# EAGLE design untitled (EAGLE 9.6.2)
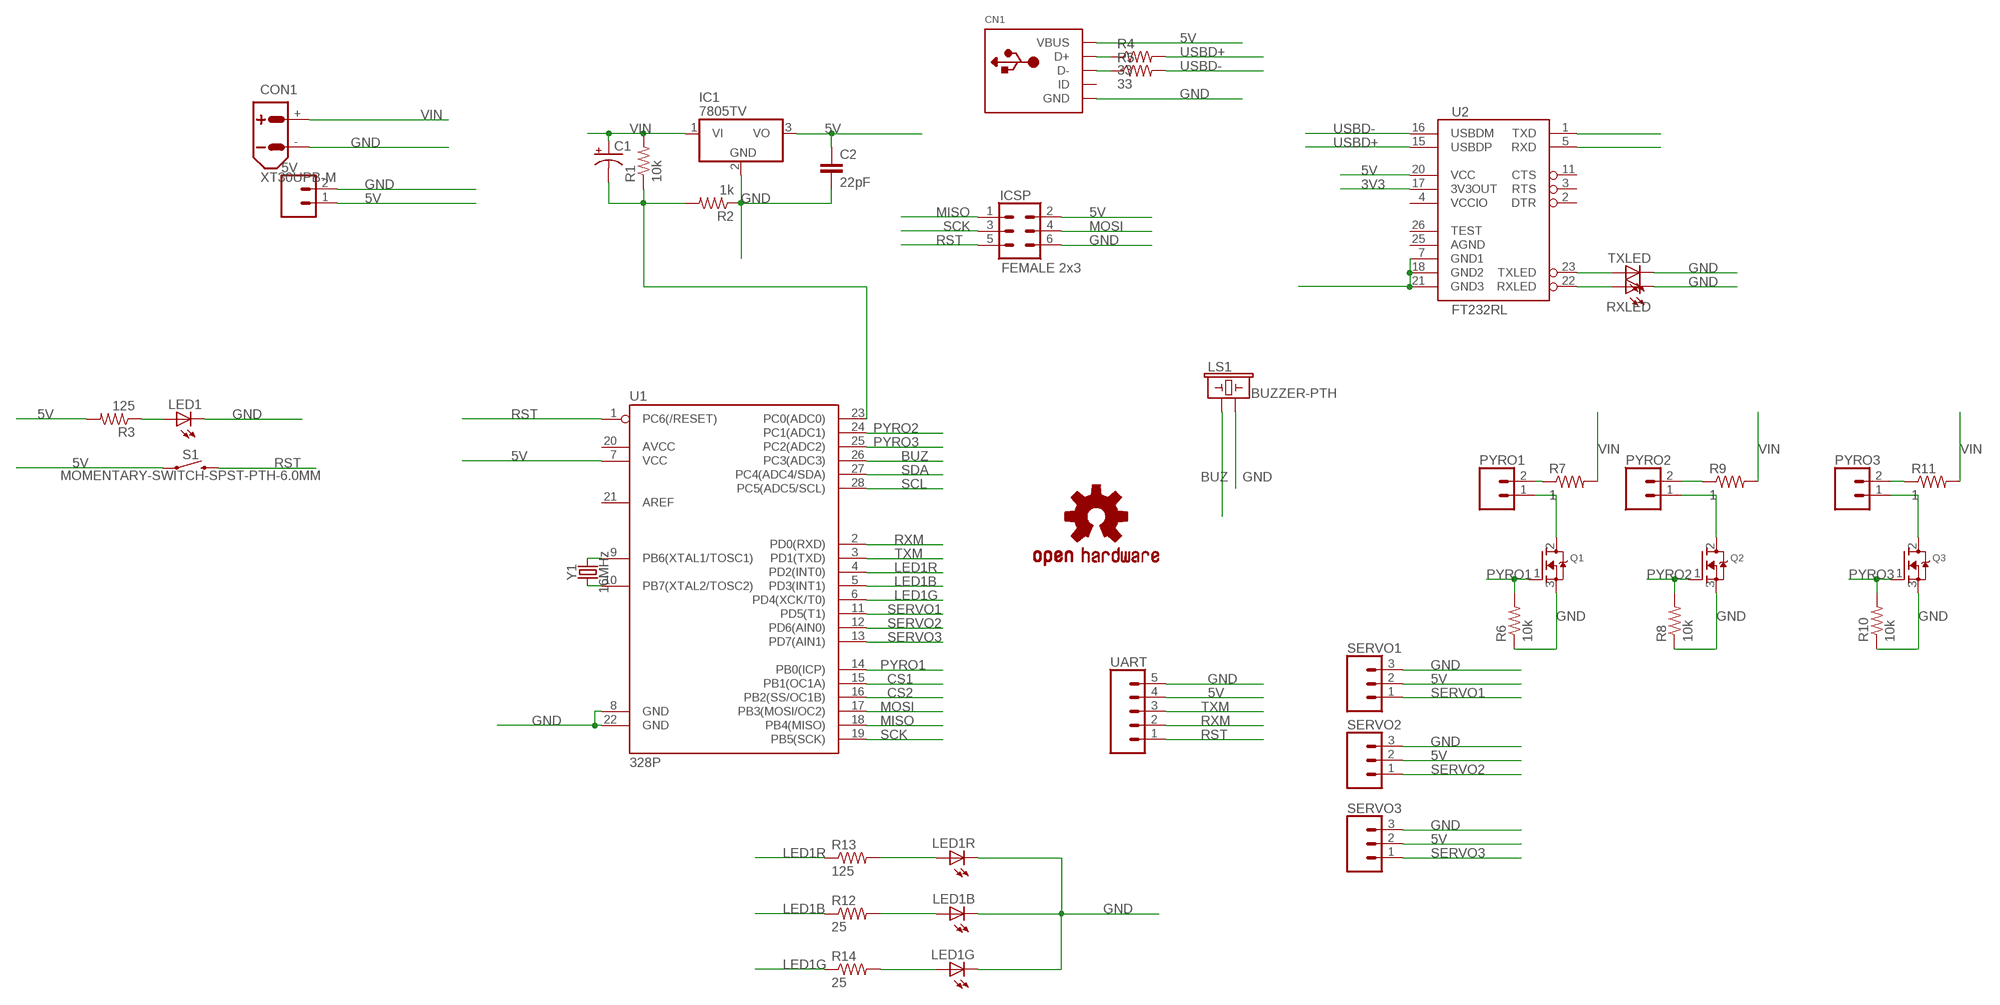
[diagram p0: schematic, sheet 1]

## Parts
5V  CONN_02  [1X02]
C1  CPOL-USE3.5-8  [E3,5-8]
C2  22pF  22PF-PTH-2.54MM-200V-5%  [CAP-PTH-2.54]
CN1  USBMINIB  [USB-MINIB]
CON1  XT30UPB-M  [XT30UPB-M]
IC1  7805TV  [TO220V]
ICSP  FEMALE 2x3  CONN_03X2FEMALE  [2X3]
LED1  LED5MM  [LED5MM]
LED1B  LED1B  LED5MM  [LED5MM]
LED1G  LED1G  LED5MM  [LED5MM]
LED1R  LED1R  LED5MM  [LED5MM]
LOGO1  OSHW-LOGOL  [OSHW-LOGO-L]
LS1  BUZZER-PTH  [BUZZER-12MM]
PYRO1  CONN_025MM  [SCREWTERMINAL-5MM-2]
PYRO2  CONN_025MM  [SCREWTERMINAL-5MM-2]
PYRO3  CONN_025MM  [SCREWTERMINAL-5MM-2]
Q1  MOSFET-NGDS_TO220V  [TO220V]
Q2  MOSFET-NGDS_TO220V  [TO220V]
Q3  MOSFET-NGDS_TO220V  [TO220V]
R1  10k  FLIPFLOP-RES  [0805-THM]
R2  1k  FLIPFLOP-RES  [0805-THM]
R3  125  FLIPFLOP-RES  [0805-THM]
R4  33  FLIPFLOP-RES  [0805-THM]
R5  33  FLIPFLOP-RES  [0805-THM]
R6  10k  FLIPFLOP-RES  [0805-THM]
R7  1  FLIPFLOP-RES  [0805-THM]
R8  10k  FLIPFLOP-RES  [0805-THM]
R9  1  FLIPFLOP-RES  [0805-THM]
R10  10k  FLIPFLOP-RES  [0805-THM]
R11  1  FLIPFLOP-RES  [0805-THM]
R12  25  FLIPFLOP-RES  [0805-THM]
R13  125  FLIPFLOP-RES  [0805-THM]
R14  25  FLIPFLOP-RES  [0805-THM]
RXLED  LED5MM  [LED5MM]
S1  MOMENTARY-SWITCH-SPST-PTH-6.0MM  [TACTILE_SWITCH_PTH_6.0MM]
SERVO1  CONN_03  [1X03]
SERVO2  CONN_03  [1X03]
SERVO3  CONN_03  [1X03]
TXLED  LED5MM  [LED5MM]
U1  328P  ATMEGA328P_PDIP  [DIP28]
U2  FT232RL  FT232RL-BASICSSOP  [SSOP28DB]
UART  CONN_05  [1X05]
Y1  16MHz  CRYSTAL-16MHZPTH-HC49US  [HC49US]

## Nets
3V3: U2.17(3V3OUT)
5V: 5V.1 C2.1 CN1.VBUS IC1.3(VO) ICSP.2 R3.2 S1.1 SERVO1.2 SERVO2.2 SERVO3.2 U1.7(VCC) U2.20(VCC) UART.4
BUZ: LS1.+ U1.26(PC3(ADC3))
CS1: U1.15(PB1(OC1A))
CS2: U1.16(PB2(SS/OC1B))
GND: 5V.2 C2.2 CN1.GND CON1.- IC1.2(GND) ICSP.6 LED1.K(C) LED1B.K(C) LED1G.K(C) LED1R.K(C) LS1.- Q1.3(S) Q2.3(S) Q3.3(S) R2.1 R6.1 R8.1 R10.1 RXLED.K(C) SERVO1.3 SERVO2.3 SERVO3.3 TXLED.K(C) U1.8(GND) U1.22(GND) UART.5
LED1B: R12.1 U1.5(PD3(INT1))
LED1G: R14.1 U1.6(PD4(XCK/T0))
LED1R: R13.1 U1.4(PD2(INT0))
MISO: ICSP.1 U1.18(PB4(MISO))
MOSI: ICSP.4 U1.17(PB3(MOSI/OC2))
N$1: U1.9(PB6(XTAL1/TOSC1)) Y1.2
N$2: U1.10(PB7(XTAL2/TOSC2)) Y1.1
N$3: C1.- R1.1 R2.2 U1.23(PC0(ADC0))
N$4: CN1.D+ R4.1
N$5: U2.7(GND1) U2.18(GND2) U2.21(GND3)
N$6: U2.1(TXD)
N$7: U2.5(RXD)
N$8: TXLED.A U2.23(TXLED)
N$9: LED1.A R3.1
N$10: CN1.D- R5.1
N$11: RXLED.A U2.22(RXLED)
N$15: PYRO1.1 Q1.2(D)
N$16: PYRO1.2 R7.1
N$17: PYRO2.1 Q2.2(D)
N$18: PYRO2.2 R9.1
N$19: PYRO3.1 Q3.2(D)
N$20: PYRO3.2 R11.1
N$21: LED1R.A R13.2
N$22: LED1B.A R12.2
N$23: LED1G.A R14.2
PYRO1: Q1.1(G) R6.2 U1.14(PB0(ICP))
PYRO2: Q2.1(G) R8.2 U1.24(PC1(ADC1))
PYRO3: Q3.1(G) R10.2 U1.25(PC2(ADC2))
RST: ICSP.5 S1.3 U1.1(PC6(/RESET)) UART.1
RXM: U1.2(PD0(RXD)) UART.2
SCK: ICSP.3 U1.19(PB5(SCK))
SCL: U1.28(PC5(ADC5/SCL))
SDA: U1.27(PC4(ADC4/SDA))
SERVO1: SERVO1.1 U1.11(PD5(T1))
SERVO2: SERVO2.1 U1.12(PD6(AIN0))
SERVO3: SERVO3.1 U1.13(PD7(AIN1))
TXM: U1.3(PD1(TXD)) UART.3
USBD+: R4.2 U2.15(USBDP)
USBD-: R5.2 U2.16(USBDM)
VIN: C1.+ CON1.+ IC1.1(VI) R1.2 R7.2 R9.2 R11.2
Unconnected: CN1.ID U1.20(AVCC) U1.21(AREF) U2.2(DTR) U2.3(RTS) U2.11(CTS) U2.26(TEST)

## Power pins joined to a net without a drawn wire
AGND: U2.25(AGND)
VCCIO: U2.4(VCCIO)

## Library data of the parts
5V = SparkFun-Connectors:CONN_02: Multi connection point. Often used as Generic Header-pin footprint for 0.1 inch spaced/style header connections On any of the 0.1 inch spaced packages, you can populate with these: Break Away Headers - Straight <https://www.sparkfun.com/products/116> (PRT-00116) Break Away Male Headers - Right Angle <https://www.sparkfun.com/products/553> (PRT-00553) Female Headers <https://www.sparkfun.com/products/115> (PRT-00115) Break Away Headers - Machine Pin <https://www.sparkfun.com/products/117> (PRT-00117) Break Away Female Headers - Swiss Machine Pin <https://www.sparkfun.com/products/743> (PRT-00743) For SCREWTERMINALS and SPRING TERMINALS visit here: Screw Terimnals on SparkFun.com <https://www.sparkfun.com/search/results?term=Screw+Terminals> (5mm/3.5mm/2.54mm spacing) This device is also useful as a general connection point to wire up your design to another part of your project. Our various solder wires solder well into these plated through hole pads. Hook-Up Wire - Assortment (Stranded, 22 AWG) <https://www.sparkfun.com/products/11375> (PRT-11375) Hook-Up Wire - Assortment (Solid Core, 22 AWG) <https://www.sparkfun.com/products/11367> (PRT-11367) View the entire wire category on our website here <https://www.sparkfun.com/categories/141> Special notes: Molex polarized connector foot print use with: PRT-08233 with associated crimp pins and housings. 2.54_SCREWTERM for use with PRT-10571. 3.5mm Screw Terminal footprints for PRT-08084 5mm Screw Terminal footprints for use with PRT-08432
C1 = rcl:CPOL-US: POLARIZED CAPACITOR, American symbol; SPICEPREFIX: C
C2 = SparkFun-Capacitors:22PF: 22pF ceramic capacitors A capacitor is a passive two-terminal electrical component used to store electrical energy temporarily in an electric field.; PROD_ID: CAP-09128
CN1 = adafruit:USB: USB Connectors USBMINIB - Surface Mount Female Mini-B USB Connector 4UConnector: 06564 By microbuilder.eu Thru-hole RA Female Mini-B USB Connector 4UConnector: 18732 By ladyada.net
CON1 = amass:XT30: AMASS XT30 connector Store in Japan AMASS XT30 connector <https://szc.jp/ams-xt30>
IC1 = linear:78*: Positive VOLTAGE REGULATOR Source: http://cache.national.com/ds/LM/LM78L05.pdf http://www.fairchildsemi.com/ds/LM/LM7805.pdf
ICSP = SparkFun-Connectors:CONN_03X2: Multi connection point. Often used as Generic Header-pin footprint for 0.1 inch spaced/style header connections You can populate with any combo of single row headers, but if you'd like an exact match, check these: Header - 2x3 (Male, 0.1") <https://www.sparkfun.com/products/12807> (PRT-12807) Header - 2x3 (Female, 0.1") <https://www.sparkfun.com/products/13010> (PRT-13010) 2x3 Pin Shrouded Header <https://www.sparkfun.com/products/10877> (PRT-10877) On any of the 0.1 inch spaced packages, you can populate with these: Break Away Headers - Straight <https://www.sparkfun.com/products/116> (PRT-00116) Break Away Male Headers - Right Angle <https://www.sparkfun.com/products/553> (PRT-00553) Female Headers <https://www.sparkfun.com/products/115> (PRT-00115) Break Away Headers - Machine Pin <https://www.sparkfun.com/products/117> (PRT-00117) Break Away Female Headers - Swiss Machine Pin <https://www.sparkfun.com/products/743> (PRT-00743) Special note: the shrouded connector mates well with our 3x2 ribbon cables: Ribbon Crimp Connector - 6-pin (2x3, Female) <https://www.sparkfun.com/products/10651> (PRT-10651) Ribbon Cable - 6 wire (15ft) <https://www.sparkfun.com/products/10646> (PRT-10646); PROD_ID: CONN-11566
LED1 LED1B LED1G LED1R RXLED TXLED = adafruit:LED: LED OSRAM: - CHIPLED LG R971, LG N971, LY N971, LG Q971, LY Q971, LO R971, LY R971 LH N974, LH R974 LS Q976, LO Q976, LY Q976 LO Q996 - Hyper CHIPLED LW Q18S LB Q993, LB Q99A, LB R99A - SideLED LS A670, LO A670, LY A670, LG A670, LP A670 LB A673, LV A673, LT A673, LW A673 LH A674 LY A675 LS A676, LA A676, LO A676, LY A676, LW A676 LS A679, LY A679, LG A679 - Hyper Micro SIDELED® LS Y876, LA Y876, LO Y876, LY Y876 LT Y87S - SmartLED LW L88C, LW L88S LB L89C, LB L89S, LG L890 LS L89K, LO L89K, LY L89K LS L896, LA L896, LO L896, LY L896 - TOPLED LS T670, LO T670, LY T670, LG T670, LP T670 LSG T670, LSP T670, LSY T670, LOP T670, LYG T670 LG T671, LOG T671, LSG T671 LB T673, LV T673, LT T673, LW T673 LH T674 LS T676, LA T676, LO T676, LY T676, LB T676, LH T676, LSB T676, LW T676 LB T67C, LV T67C, LT T67C, LS T67K, LO T67K, LY T67K, LW E67C LS E67B, LA E67B, LO E67B, LY E67B, LB E67C, LV E67C, LT E67C LW T67C LS T679, LY T679, LG T679 LS T770, LO T770, LY T770, LG T770, LP T770 LB T773, LV T773, LT T773, LW T773 LH T774 LS E675, LA E675, LY E675, LS T675 LS T776, LA T776, LO T776, LY T776, LB T776 LHGB T686 LT T68C, LB T68C - Hyper Mini TOPLED® LB M676 - Mini TOPLED Santana® LG M470 LS M47K, LO M47K, LY M47K Source: http://www.osram.convergy.de/
LOGO1 = SparkFun-Aesthetics:OSHW-LOGO: Open-Source Hardware (OSHW) Logo This logo indicates the piece of hardware it is found on incorporates a OSHW license and/or adheres to the definition of open source hardware found here: http://freedomdefined.org/OSHW
LS1 = SparkFun-Electromechanical:BUZZER: Buzzer Small round buzzers that operate around the audible 2kHz range. You can use these as speakers to create simple music or user interfaces. Variant Overview: PTH - Mini Speaker - PC Mount 12mm 2.048kHz <https://www.sparkfun.com/products/7950> PTH_KIT - Mini Speaker - PC Mount 12mm 2.048kHz <https://www.sparkfun.com/products/7950> KIT simplifies soldering by adding stop mask to one side of the pads. PTH_NO_SILK - Mini Speaker - PC Mount 12mm 2.048kHz <https://www.sparkfun.com/products/7950> No silkscreen indicator of buzzer outline. PTH_KIT_NO_SILK - Mini Speaker - PC Mount 12mm 2.048kHz <https://www.sparkfun.com/products/7950> KIT package w/o silkscreen SMD - Buzzer Audio Magnetic (CCV-084B16) SMD buzzer used on, e.g. the LilyPad Buzzer <https://www.sparkfun.com/products/8463> and RFID USB Reader <https://www.sparkfun.com/products/9963>. SMD_KIT - Buzzer Audio Magnetic (CCV-084B16) SMD Buzzer with elongated pins to make soldering easier. Used on the SparkFun Simon Says - Surface Mount Soldering Kit <https://www.sparkfun.com/products/10935>.; PROD_ID: COMP-08253; SF_SKU: COM-07950
PYRO1-PYRO3 = SparkFun-Connectors:CONN_02: Multi connection point. Often used as Generic Header-pin footprint for 0.1 inch spaced/style header connections On any of the 0.1 inch spaced packages, you can populate with these: Break Away Headers - Straight <https://www.sparkfun.com/products/116> (PRT-00116) Break Away Male Headers - Right Angle <https://www.sparkfun.com/products/553> (PRT-00553) Female Headers <https://www.sparkfun.com/products/115> (PRT-00115) Break Away Headers - Machine Pin <https://www.sparkfun.com/products/117> (PRT-00117) Break Away Female Headers - Swiss Machine Pin <https://www.sparkfun.com/products/743> (PRT-00743) For SCREWTERMINALS and SPRING TERMINALS visit here: Screw Terimnals on SparkFun.com <https://www.sparkfun.com/search/results?term=Screw+Terminals> (5mm/3.5mm/2.54mm spacing) This device is also useful as a general connection point to wire up your design to another part of your project. Our various solder wires solder well into these plated through hole pads. Hook-Up Wire - Assortment (Stranded, 22 AWG) <https://www.sparkfun.com/products/11375> (PRT-11375) Hook-Up Wire - Assortment (Solid Core, 22 AWG) <https://www.sparkfun.com/products/11367> (PRT-11367) View the entire wire category on our website here <https://www.sparkfun.com/categories/141> Special notes: Molex polarized connector foot print use with: PRT-08233 with associated crimp pins and housings. 2.54_SCREWTERM for use with PRT-10571. 3.5mm Screw Terminal footprints for PRT-08084 5mm Screw Terminal footprints for use with PRT-08432; SF_SKU: PRT-08432
Q1-Q3 = adafruit:MOSFET-N: N-Channel Mosfet 2N7002E - 60V 260mA SOT23 [Digikey: 2N7002ET1GOSTR-ND] - REEL BSH103 - 30V 850mA SOT23 [Digikey: 568-5013-1-ND]
R1-R14 = adafruit:FLIPFLOP-RES: Flip Flop resistor An 0805 resistor inside a standard 1/4W 5% resistor. Makes for easy mods
S1 = SparkFun-Switches:MOMENTARY-SWITCH-SPST: Momentary Switch (Pushbutton) - SPST Normally-open (NO) SPST momentary switches (buttons, pushbuttons). Variants PTH-12MM - 12mm square, through-hole Momentary Pushbutton Switch - 12mm Square <https://www.sparkfun.com/products/9190> (COM-09190) PTH-6.0MM, PTH-6.0MM-KIT - 6.0mm square, through-hole Mini Pushbutton Switch <https://www.sparkfun.com/products/97> (COM-00097) KIT package intended for soldering kit's - only one side of pads' copper is exposed. PTH-RIGHT-ANGLE-KIT - Right-angle, through-hole Right Angle Tactile Button <https://www.sparkfun.com/products/10791> - Used on SparkFun BigTime Watch Kit <https://www.sparkfun.com/products/11734> SMD-12MM - 12mm square, surface-mount Tactile Button - SMD (12mm) <https://www.sparkfun.com/products/12993> (COM-12993) Used on SparkFun PicoBoard <https://www.sparkfun.com/products/11888> SMD-4.5MM - 4.5mm Square Trackball Switch Used on SparkFun Blackberry Trackballer Breakout <https://www.sparkfun.com/products/13169> SMD-4.6MMX2.8MM - 4.60mm x 2.80mm, surface mount Used on SparkFun SAMD21 Mini Breakout <https://www.sparkfun.com/products/13664> SMD-5.2MM, SMD-5.2-REDUNDANT - 5.2mm square, surface-mount Mini Pushbutton Switch - SMD <https://www.sparkfun.com/products/8720> (COM-08720) Used on Arduino Pro Mini <https://www.sparkfun.com/products/11114> REDUNDANT package connects both switch circuits together SMD-6.0X3.5MM - 6.0 x 3.5mm, surface mount Momentary Reset Switch SMD <https://www.sparkfun.com/products/8229> (COM-08229) SMD-6.2MM-TALL - 6.2mm square, surface mount Tactile Button - SMD (6mm) <https://www.sparkfun.com/products/12992> Used on SparkFun Digital Sandbox <https://www.sparkfun.com/products/12651> SMD-RIGHT-ANGLE - Right-angle, surface mount Used on SparkFun Block for Intel® Edison - Arduino <https://www.sparkfun.com/products/13036>; PROD_ID: SWCH-08441; SF_SKU: COM-00097
SERVO1-SERVO3 = SparkFun-Connectors:CONN_03: Multi connection point. Often used as Generic Header-pin footprint for 0.1 inch spaced/style header connections On any of the 0.1 inch spaced packages, you can populate with these: Break Away Headers - Straight <https://www.sparkfun.com/products/116> (PRT-00116) Break Away Male Headers - Right Angle <https://www.sparkfun.com/products/553> (PRT-00553) Female Headers <https://www.sparkfun.com/products/115> (PRT-00115) Break Away Headers - Machine Pin <https://www.sparkfun.com/products/117> (PRT-00117) Break Away Female Headers - Swiss Machine Pin <https://www.sparkfun.com/products/743> (PRT-00743) Stackable Header - 3 Pin (Female, 0.1") <https://www.sparkfun.com/products/13875> (PRT-13875) For SCREWTERMINALS and SPRING TERMINALS visit here: Screw Terimnals on SparkFun.com <https://www.sparkfun.com/search/results?term=Screw+Terminals> (5mm/3.5mm/2.54mm spacing) This device is also useful as a general connection point to wire up your design to another part of your project. Our various solder wires solder well into these plated through hole pads. Hook-Up Wire - Assortment (Stranded, 22 AWG) <https://www.sparkfun.com/products/11375> (PRT-11375) Hook-Up Wire - Assortment (Solid Core, 22 AWG) <https://www.sparkfun.com/products/11367> (PRT-11367) View the entire wire category on our website here <https://www.sparkfun.com/categories/141> Special notes: Molex polarized connector foot print use with SKU : PRT-08232 with associated crimp pins and housings.
U1 = SparkFun-IC-Microcontroller:ATMEGA328P_PDIP: Atmel 328P Through hole ATMEGA328P uC used in the Arduino 32kb flash, 1k EEPROM, 2k SRAM Datasheet <http://www.sparkfun.com/datasheets/Components/SMD/ATMega328.pdf> SparkFun Products Storefront component: AVR 28 Pin 20MHz 32K 6A/D - ATMega328P <https://www.sparkfun.com/products/9061> (COM-09061) SparkFun Simon Says - Through-Hole Soldering Kit <https://www.sparkfun.com/products/10547> (KIT-10547) SparkFun Learn to Solder - Simon Says <https://www.sparkfun.com/products/13708> (KIT-13708) SparkFun BigTime Watch Kit <https://www.sparkfun.com/products/11734> (KIT-11734) SparkFun ClockIt <https://www.sparkfun.com/products/10930> (KIT-10930) SparkFun Serial Enabled LCD Kit <https://www.sparkfun.com/products/10097> (LCD-10097) SparkFun Simon Tilts - Through Hole Soldering Kit <https://www.sparkfun.com/products/12634> (KIT-12634) SparkFun Frequency Counter Kit <https://www.sparkfun.com/products/10140> (KIT-10140) FabFM Radio Kit <https://www.sparkfun.com/products/11043> (KIT-11043) SparkFun Binary Blaster Kit <https://www.sparkfun.com/products/12037> (KIT-12037) SparkFun Metro-Gnome <https://www.sparkfun.com/products/9236> (KIT-09236) ATmega328 with Arduino Optiboot (Uno) <https://www.sparkfun.com/products/10524> (DEV-10524); PROD_ID: IC-09136
U2 = SparkFun-IC-Comms:FT232RL-BASIC: FT232RL USB UART This is the simplified version of the FT232RL unit. Only what you need, nothing you don't. FT232RL 4th Generation USB UART (USB <-> Serial) Controller. Datasheet <http://www.sparkfun.com/datasheets/IC/FT232R_v104.pdf> SparkFun Products Component <https://www.sparkfun.com/products/650> (COM-00650) SparkFun RedBot Mainboard <https://www.sparkfun.com/products/12097> (ROB-12097) SparkFun FTDI Basic Breakout - 5V <https://www.sparkfun.com/products/9716> (DEV-09716) SparkFun FTDI Basic Breakout - 3.3V <https://www.sparkfun.com/products/9873> (DEV-09873) Bus Pirate - v3.6a <https://www.sparkfun.com/products/12942> (TOL-12942) SparkFun USB to Serial Breakout - FT232RL <https://www.sparkfun.com/products/12731> (BOB-12731) SparkFun PicoBoard <https://www.sparkfun.com/products/11888> (WIG-11888) SparkFun RFID USB Reader <https://www.sparkfun.com/products/9963> (SEN-09963) LilyPad FTDI Basic Breakout - 5V <https://www.sparkfun.com/products/10275> (DEV-10275) SparkFun Stepoko <https://www.sparkfun.com/products/13899> (ROB-13899); PROD_ID: IC-00870
UART = SparkFun-Connectors:CONN_05: Multi connection point. Often used as Generic Header-pin footprint for 0.1 inch spaced/style header connections On any of the 0.1 inch spaced packages, you can populate with these: Break Away Headers - Straight <https://www.sparkfun.com/products/116> (PRT-00116) Break Away Male Headers - Right Angle <https://www.sparkfun.com/products/553> (PRT-00553) Female Headers <https://www.sparkfun.com/products/115> (PRT-00115) Break Away Headers - Machine Pin <https://www.sparkfun.com/products/117> (PRT-00117) Break Away Female Headers - Swiss Machine Pin <https://www.sparkfun.com/products/743> (PRT-00743) For SCREWTERMINALS and SPRING TERMINALS visit here: Screw Terimnals on SparkFun.com <https://www.sparkfun.com/search/results?term=Screw+Terminals> (5mm/3.5mm/2.54mm spacing) This device is also useful as a general connection point to wire up your design to another part of your project. Our various solder wires solder well into these plated through hole pads. Hook-Up Wire - Assortment (Stranded, 22 AWG) <https://www.sparkfun.com/products/11375> (PRT-11375) Hook-Up Wire - Assortment (Solid Core, 22 AWG) <https://www.sparkfun.com/products/11367> (PRT-11367) View the entire wire category on our website here <https://www.sparkfun.com/categories/141> Special notes: Molex polarized connector foot print use with SKU : PRT-08231 with associated crimp pins and housings. 1MM SMD Version SKU: PRT-10208
Y1 = SparkFun-Clocks:CRYSTAL-16MHZ: 16MHz Crystal Digikey Example <http://www.digikey.com/product-search/en?keywords=535-9122-1-ND> Frequency: 16MHz Frequency Stability: ±50ppm Frequency Tolerance: ±20ppm Load Capacitance: 18pF SparkFun Products: Pro Micro -5V/16MHz <https://www.sparkfun.com/products/12640> SparkFun Serial Enabled LCD Kit <https://www.sparkfun.com/products/10097>; PROD_ID: XTAL-08181; SF_ID: COM-00536

## Net classes
0 default: width 0.1 mm, drill 0.15 mm

## Board
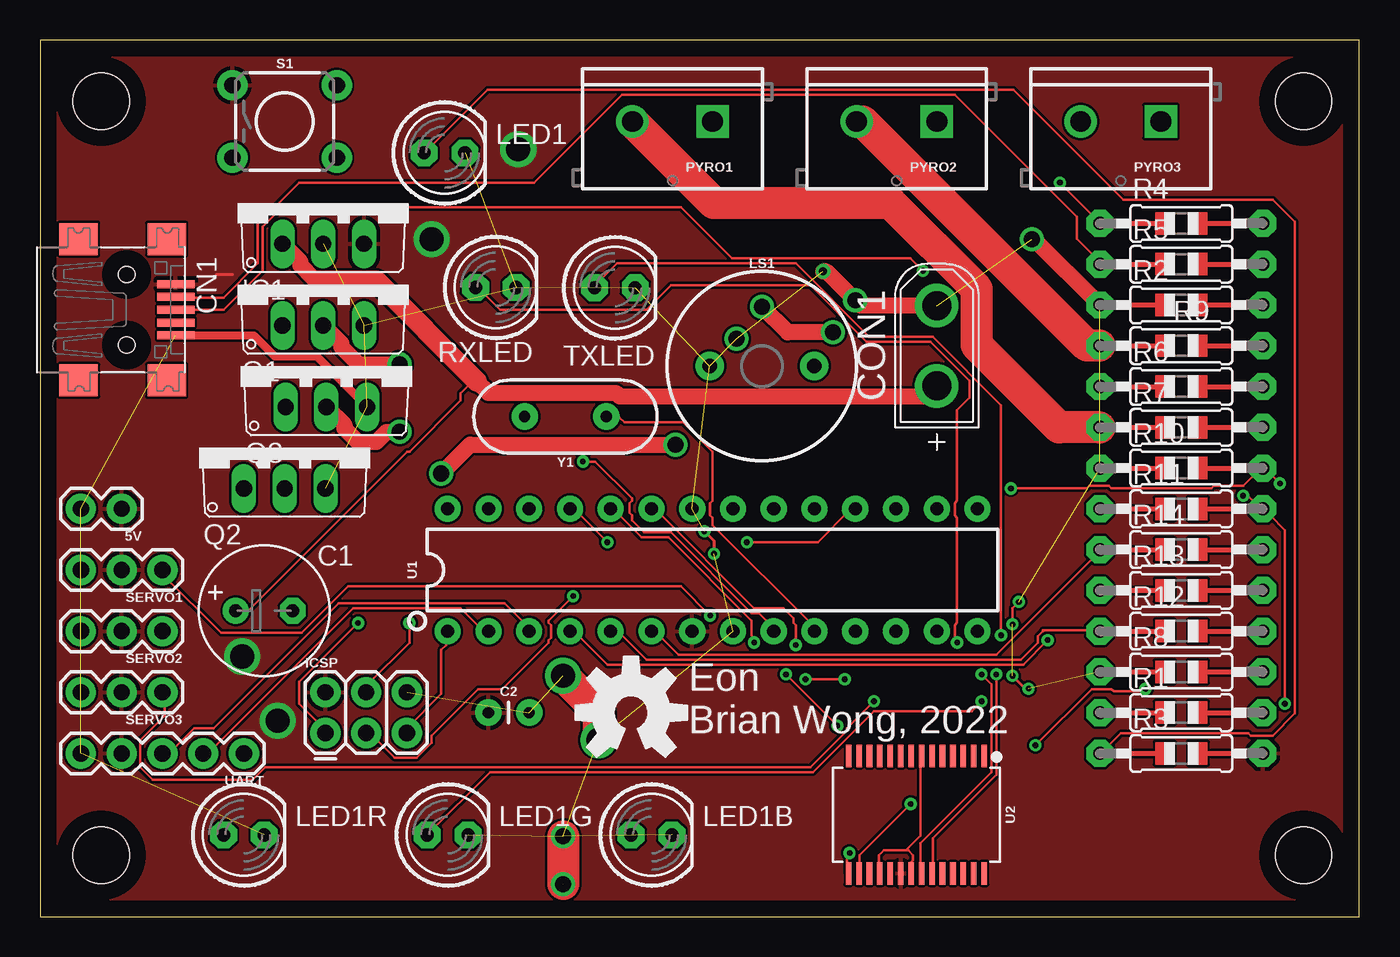
[diagram p1: board, top side]
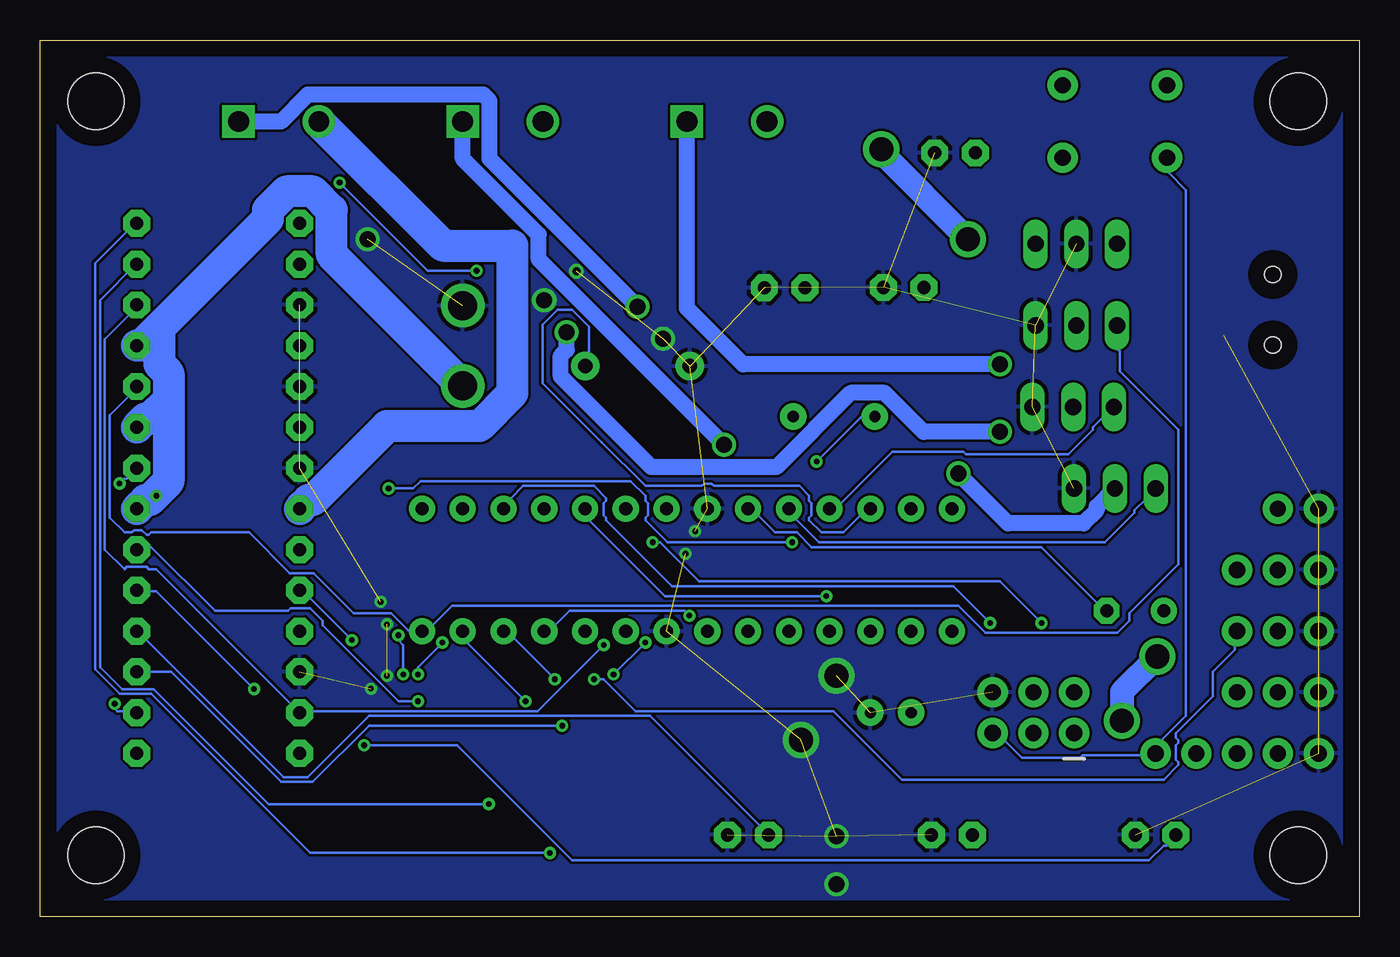
[diagram p2: board, bottom side, seen from below]

Size 82.22 x 54.6 mm. Coordinates in mm from the lower left corner, seen from the top.
Outline: 0,0 82.22,0 82.22,54.6 0,54.6 0,0
Copper layers (1*16): Top 0.035mm / dielectric 1.5mm / Bottom 0.035mm
Design rules "default *": minimum track width 6mil, minimum drill 0.35mm, track to track 6mil, track to pad 6mil, pad to pad 6mil, via to via 6mil, smd to smd 6mil, copper to edge 40mil, drill to drill 6mil, minimum pad ring 10mil, minimum via ring 8mil, stop-mask expansion 4mil, vias tented up to drill 0mil, thermal gap 10mil
Holes 3.5 mm at 3.81,3.81 78.74,3.81 3.81,50.8 78.74,50.8

### Footprints (pad centres in the part's own frame; a part is rotated, then mirrored left to right if it is on the bottom)
1X02 = drill 1.016 pad 1.88: 1 0,0; 2 2.54,0
E3,5-8 = drill 0.813 pad 1.6: + -1.778,0 | drill 0.813 pad 1.6 octagon: - 1.778,0
CAP-PTH-2.54 = drill 0.7 pad 1.651: 1 -1.27,0; 2 1.27,0
USB-MINIB = smd 0.5 x 2.308: D+ 0,4.064; D- -0.8,4.064; GND 1.6,4.064; ID 0.8,4.064; VBUS -1.6,4.064 | smd 2 x 2.4: GND1 -4.4,-2; GND2 -4.4,3.5; GND3 4.4,3.5; GND4 4.4,-2 | hole 1: -2.2,1; 2.2,1
XT30UPB-M = drill 1.8: + 2.5,0; - -2.5,0
TO220V = drill 1.016 long: 1 -2.54,-2.54; 2 0,-2.54; 3 2.54,-2.54
2X3 = drill 1.016 pad 1.88: 1 0,0; 2 0,2.54; 3 2.54,0; 4 2.54,2.54; 5 5.08,0; 6 5.08,2.54
LED5MM = drill 0.813 pad 1.676 octagon: A -1.27,0; K 1.27,0
BUZZER-12MM = drill 0.9 pad 1.778: + 3.25,0; - -3.25,0
SCREWTERMINAL-5MM-2 = drill 1.3 pad 2.032 square: 1 0,0 | drill 1.3 pad 2.032: 2 5,0
0805-THM = drill 0.813 pad 1.676 octagon: 1 -5.08,0; 2 5.08,0
TACTILE_SWITCH_PTH_6.0MM = drill 1.016 pad 1.88: 1 -3.251,2.261; 2 3.251,2.261; 3 -3.251,-2.261; 4 3.251,-2.261
1X03 = drill 1.016 pad 1.88: 1 0,0; 2 2.54,0; 3 5.08,0
DIP28 = drill 0.813 pad 1.626: 1 -16.51,-3.81; 2 -13.97,-3.81; 3 -11.43,-3.81; 4 -8.89,-3.81; 5 -6.35,-3.81; 6 -3.81,-3.81; 7 -1.27,-3.81; 8 1.27,-3.81; 9 3.81,-3.81; 10 6.35,-3.81; 11 8.89,-3.81; 12 11.43,-3.81; 13 13.97,-3.81; 14 16.51,-3.81; 15 16.51,3.81; 16 13.97,3.81; 17 11.43,3.81; 18 8.89,3.81; 19 6.35,3.81; 20 3.81,3.81; 21 1.27,3.81; 22 -1.27,3.81; 23 -3.81,3.81; 24 -6.35,3.81; 25 -8.89,3.81; 26 -11.43,3.81; 27 -13.97,3.81; 28 -16.51,3.81
SSOP28DB = smd 0.348 x 1.397: 1 -4.225,-3.656; 2 -3.575,-3.656; 3 -2.925,-3.656; 4 -2.275,-3.656; 5 -1.625,-3.656; 6 -0.975,-3.656; 7 -0.325,-3.656; 8 0.325,-3.656; 9 0.975,-3.656; 10 1.625,-3.656; 11 2.275,-3.656; 12 2.925,-3.656; 13 3.575,-3.656; 14 4.225,-3.656; 15 4.225,3.656; 16 3.575,3.656; 17 2.925,3.656; 18 2.275,3.656; 19 1.625,3.656; 20 0.975,3.656; 21 0.325,3.656; 22 -0.325,3.656; 23 -0.975,3.656; 24 -1.625,3.656; 25 -2.275,3.656; 26 -2.925,3.656; 27 -3.575,3.656; 28 -4.225,3.656
1X05 = drill 1.016 pad 1.88: 1 0,0; 2 2.54,0; 3 5.08,0; 4 7.62,0; 5 10.16,0
HC49US = drill 0.7 pad 1.651: 1 -2.54,0; 2 2.54,0

### Placement (x,y rotation side)
5V  5.08,25.4 180 top
C1  13.97,19.05 0 top
C2  29.21,12.7 0 top
CN1  4.4,37.8 270 top
CON1  55.88,35.56 270 top
IC1  17.64,44.45 0 top
ICSP  17.78,11.43 0 top
LED1  25.2,47.57 0 top
LED1B  38.1,5.08 0 top
LED1G  25.4,5.08 0 top
LED1R  12.7,5.08 0 top
LOGO1  36.83,12.7 0 top
LS1  44.98,34.29 0 top
PYRO1  41.91,49.53 180 top
PYRO2  55.88,49.53 180 top
PYRO3  69.85,49.53 180 top
Q1  17.64,39.37 0 top
Q2  15.24,29.21 0 top
Q3  17.84,34.29 0 top
R1  71.12,12.7 0 top
R2  71.12,38.1 0 top
R3  71.12,10.16 0 top
R4  71.12,43.18 0 top
R5  71.12,40.64 0 top
R6  71.12,33.02 0 top
R7  71.12,30.48 0 top
R8  71.12,15.24 0 top
R9  71.12,35.56 0 top
R10  71.12,27.94 0 top
R11  71.12,25.4 0 top
R12  71.12,17.78 0 top
R13  71.12,20.32 0 top
R14  71.12,22.86 0 top
RXLED  28.4,39.19 0 top
S1  15.24,49.53 0 top
SERVO1  7.62,21.59 180 top
SERVO2  7.62,17.78 180 top
SERVO3  7.62,13.97 180 top
TXLED  35.82,39.17 0 top
U1  41.91,21.59 0 top
U2  54.61,6.35 180 top
UART  12.7,10.16 180 top
Y1  32.74,31.15 180 top

### Tracks (layer width: path | path; a pad name or v marks a point on that pad's centre or on a via)
5V  (via drill 1.5)
  Top 0.2: CN1.VBUS 8.61,39.55 | 10.99,40 12,40
  Bottom 1.5: v12.6,16.2 14.8,14 v14.8,12.2 | v24.4,42.2 29.8,47.6 v29.8,47.8
  pour Top: -5.08,58.42 -5.08,0 3.81,-8.89 74.93,-8.89 91.44,7.62 91.44,48.26 80.01,59.69 -3.81,59.69
BUZ
  Bottom 0.152: U1.26 30.48,25.3 30.79,25.3 32.16,23.93 33.53,23.93 34.29,24.69 34.29,24.84 34.14,24.99 34.14,25.76 34.29,25.91 34.29,26.21 34.9,26.82 40.23,26.82 40.39,26.98 40.84,26.98 41,26.82 44.5,26.82 47.24,29.56 50.9,33.22 50.9,36.88 49.99,37.8 49.07,37.8 48.01,36.73 48.01,34.44 48.16,34.29 LS1.+
GND  (via drill 0.35, 0.5, 1, 1.5)  (31 unrouted)
  Top 0.152: 9.42,36.27 CN1.GND | v60.6,18.2 60.6,19.2 v61,19.6
  Top 0.2: 9.4,36.2 CN1.GND | v41.4,24 42,23.4 v42,22.6 | v61.6,14.2 61.4,14.2 v60.6,15
  Top 0.5: Q3.3 17.23,34.9 14.62,34.9 13.32,36.2 CN1.GND
  Top 1: R2.1 61.94,42.2 v61.8,42.2 | CON1.- 51.14,38.06 v50.8,38.4 49,40.2 v48.8,40.2
  Top 2: v32.6,15 34.8,12.8 v34.8,11 | v32.6,5 32.6,2.02
  other vias: 32.6,2 43.4,36
  pour Bottom: -6.35,62.23 -6.35,0 5.08,-11.43 80.01,-11.43 88.9,-2.54 93.98,2.54 93.98,24.13 93.98,48.26 80.01,62.23
LED1B
  Top 0.152: U1.5 35.66,17.68 36.12,17.68 37.8,16 61.14,16 62.18,17.05 62.18,17.47 62.48,17.77 62.48,17.83 65.99,17.83 R12.1
LED1G
  Top 0.152: U1.6 38.1,17.68 38.41,17.68 39.78,16.31 59.59,16.31 66.14,22.86 R14.1
LED1R  (via drill 0.35)
  Top 0.152: v62.79,17.22 61.27,15.7 35.36,15.7 33.38,17.68 33.07,17.68 U1.4
  Bottom 0.152: v62.79,17.22 65.99,20.42 R13.1
MISO  (via drill 0.35)
  Top 0.152: v44.04,23.32 48.46,23.32 50.44,25.3 50.75,25.3 U1.18 | v19.81,18.29 16.15,14.63 16.15,13.26 17.68,11.73 17.68,11.43 ICSP.1
  Bottom 0.152: v44.04,23.32 43.59,23.32 41.15,20.88 22.4,20.88 v19.81,18.29
MOSI  (via drill 0.35)
  Top 0.152: v23.01,18.29 23.01,17.07 20.42,14.48 20.42,14.02 ICSP.4
  Bottom 0.152: v23.01,18.29 25.3,20.57 42.82,20.57 46.94,24.69 46.94,24.84 47.09,24.99 47.09,25.76 46.94,25.91 46.94,26.06 47.7,26.82 52.12,26.82 52.88,26.06 52.88,25.91 53.34,25.45 U1.17
N$1  (via drill 0.35)
  Top 0.152: v33.83,28.35 34.59,28.35 36.88,26.06 36.88,25.91 36.73,25.76 36.73,25.15 36.88,24.99 36.88,24.69 37.64,23.93 39.32,23.93 44.35,18.9 44.81,18.9 45.26,18.44 45.26,18.29 45.72,17.83 U1.9
  Bottom 0.152: v33.83,28.35 31.09,31.09 30.33,31.09 Y1.2
N$2
  Top 0.152: U1.10 48.16,17.83 48.16,18.14 41.91,24.38 41.91,24.84 41.76,24.99 41.76,25.76 41.91,25.91 41.91,28.96 40.08,30.79 36.42,30.79 36.12,31.09 35.36,31.09 Y1.1
N$3  (via drill 0.35)
  Top 0.152: v47.09,16.92 46.94,17.07 46.94,17.22 47.09,17.37 47.09,18.14 46.94,18.29 46.94,18.59 46.33,19.2 44.5,19.2 38.41,25.3 38.1,25.3 U1.23
  Bottom 0.152: C1.- 15.85,19.05 19.81,23.01 34.14,23.01 35.05,23.93 36.42,23.93 37.8,25.3 38.1,25.3 U1.23 | R2.2 76.2,37.95 78.18,35.97 78.18,22.86 76.96,21.64 76.81,21.79 75.59,21.79 75.44,21.64 74.98,21.64 R1.1 65.99,12.8 51.21,12.8 v47.09,16.92
N$4  (via drill 0.35)
  Top 0.152: v55.02,40.23 54.25,41 43.13,41 39.93,44.2 15.09,44.2 13.87,42.98 13.87,40.23 11.43,37.8 8.51,37.8 CN1.D+ | v63.55,45.72 65.99,43.28 R4.1
  Bottom 0.152: v55.02,40.23 58.06,40.23 v63.55,45.72
N$5
  Top 0.152: 53.95,4.12 54.1,4.12 54.41,3.81 54.41,3.5 54.25,3.35 54.25,2.74 U2.21 | 53.95,4.12 52.58,4.12 52.27,3.81 52.27,2.74 U2.18 | 53.95,4.12 54.86,5.03 54.86,9.91 U2.7
N$8  (via drill 0.35)
  Top 0.152: v59.59,15.09 59.59,8.84 55.63,4.88 55.63,2.74 U2.23 | v59.89,17.53 59.89,31.85 55.63,36.12 51.66,36.12 47.09,40.69 35.97,40.69 34.59,39.32 TXLED.A
  Bottom 0.152: v59.59,15.09 59.59,16.92 59.89,17.22 v59.89,17.53
N$9
  Top 0.152: LED1.A 24.08,47.7 27.89,51.51 60.66,51.51 67.51,44.65 76.81,44.65 78.18,43.28 78.18,12.65 76.81,11.28 75.44,11.28 75.29,11.43 67.36,11.43 66.6,10.67 66.45,10.67 65.99,10.21 R3.1
N$10
  Top 0.152: CN1.D- 8.51,38.56 11.43,38.56 13.56,40.69 13.56,43.13 16.15,45.72 30.79,45.72 36.27,51.21 57,51.21 64.62,43.59 64.62,42.22 66.14,40.69 R5.1
N$11  (via drill 0.35)
  Top 0.152: v58.67,15.09 59.28,14.48 59.28,8.99 54.86,4.57 54.86,2.74 U2.22 | v57.15,17.07 57.15,17.22 57,17.37 57,18.14 57.15,18.29 57.15,24.84 57,24.99 57,25.76 57.15,25.91 57.15,31.55 57.91,32.31 57.91,33.38 55.47,35.81 51.51,35.81 48.01,39.32 39.32,39.32 37.8,37.8 28.65,37.8 27.28,39.17 RXLED.A
  Bottom 0.152: v58.67,15.09 58.67,15.54 v57.15,17.07
N$15  (via drill 1)
  Top 1: Q1.2 18.77,35.7 18.77,35.48 19.85,34.4 v22.4,34.4
  Bottom 1: v22.4,34.4 38.4,34.4 41.91,37.91 PYRO1.1
N$16
  Top 2: R7.1 63.5,30.48 58.38,35.6 58.38,39.1 53.03,44.45 41.99,44.45 PYRO1.2
N$17  (via drill 1)
  Top 1: v25,27.6 26.8,29.4 v39.6,29.4
  Bottom 1: Q2.2 16.37,25.54 16.37,25.32 17.19,24.49 21.89,24.49 v25,27.6 | v39.6,29.4 51.15,40.95 51.15,42.48 55.88,47.22 PYRO2.1
N$18
  Top 2: R9.1 65.24,35.56 51.27,49.53 PYRO2.2
N$19  (via drill 1)
  Top 1: Q3.2 18.97,30.62 18.97,30.4 19.79,29.57 20.97,29.57 21.59,30.2 v22.4,30.2 | v49.4,36.4 46.6,36.4 v45,38
  Bottom 1: v22.4,30.2 27.16,30.2 29.59,32.63 31.71,32.63 36.34,28 44.12,28 49.77,33.65 49.77,34.93 49.4,35.3 v49.4,36.4 | PYRO3.1 67.21,49.53 65.54,51.2 54.59,51.2 54.21,50.82 54.21,47.21 v45,38
N$20
  Bottom 2: R11.1 65.49,25.95 65.22,25.95 60.61,30.56 54.84,30.56 52.8,32.6 52.8,41.8 57.12,41.8 PYRO3.2
N$21  (via drill 0.35)
  Top 0.152: v62.03,10.67 65.53,14.17 66.75,14.17 66.9,14.02 68.73,14.02 v68.89,14.17
  Bottom 0.152: v62.03,10.67 56.24,10.67 49.07,3.5 13.11,3.5 12.19,4.42 12.04,4.42 11.43,5.03 LED1R.A | v68.89,14.17 74.98,20.27 76.2,20.27 R13.2
N$22
  Bottom 0.152: LED1B.A 36.88,5.18 44.2,12.5 61.72,12.5 65.53,8.69 67.06,8.69 76.2,17.83 R12.2
N$23  (via drill 0.35)
  Top 0.152: LED1G.A 28.04,8.99 48.16,8.99 51.97,12.8 58.06,12.8 v58.67,13.41
  Bottom 0.152: v58.67,13.41 59.89,13.41 64.62,18.14 64.62,18.44 65.38,19.2 66.6,19.2 66.75,19.05 71.32,19.05 75.29,23.01 76.05,23.01 R14.2
PYRO1
  Bottom 0.152: Q1.1 15.09,36.73 15.09,35.36 14.94,35.2 14.94,33.98 11.28,30.33 11.28,21.95 14.33,18.9 14.33,18.44 15.09,17.68 23.32,17.68 24.99,19.36 56.54,19.36 58.06,17.83 58.37,17.83 U1.14 58.52,17.83 59.28,17.83 60.34,18.89 62.67,18.89 65.18,21.39 66.66,21.39 69.19,23.93 75.29,23.93 75.44,23.77 75.59,23.77 75.89,24.08 76.35,24.08 76.5,23.93 76.96,23.93 77.88,24.84 77.88,31.24 76.2,32.92 R6.2
PYRO2  (via drill 0.35)
  Top 0.152: v46.48,15.09 v49.68,11.89 | v44.5,17.07 44.5,17.37 44.35,17.53 44.35,18.44 39.17,23.62 37.49,23.62 35.66,25.45 U1.24
  Bottom 0.152: Q2.1 12.8,26.67 13.26,26.21 13.26,26.06 14.02,25.3 14.02,25.15 15.85,23.32 33.68,23.32 35.66,25.3 U1.24 | R8.2 74.07,15.24 67.21,8.38 65.23,8.38 61.72,11.89 v49.68,11.89 | v44.5,17.07 v46.48,15.09
PYRO3  (via drill 0.35)
  Top 0.152: v77.27,26.98 76.81,27.43 75.59,27.43 74.98,26.82 73.15,26.82 73,26.67 66.75,26.67 66.6,26.82 65.38,26.82 65.23,26.67 v60.5,26.67 | v35.36,23.32 33.38,25.3 33.07,25.3 U1.25
  Bottom 0.152: Q3.1 15.39,31.7 16.61,30.48 16.61,30.33 18.14,28.8 24.54,28.8 24.69,28.96 29.11,28.96 32.61,25.45 32.92,25.45 U1.25 | v77.27,26.98 76.96,27.28 76.81,27.28 76.2,27.89 R10.2 | v60.5,26.67 58.98,26.67 58.52,27.13 45.41,27.13 44.5,26.21 44.5,25.91 44.35,25.76 44.35,24.99 44.5,24.84 44.5,24.69 43.13,23.32 v35.36,23.32
RST
  Top 0.152: ICSP.5 22.86,11.73 24.99,13.87 24.99,16.61 25.3,16.92 25.3,17.68 U1.1
  Bottom 0.152: ICSP.5 22.55,11.43 21.03,9.91 17.37,9.91 17.22,10.06 12.8,10.06 UART.1 12.65,10.21 12.65,10.67 10.82,12.5 10.82,45.26 11.89,46.33 11.89,47.24 S1.3
RXM
  Top 0.152: U1.2 27.89,17.83 27.58,17.83 26.21,19.2 19.51,19.2 10.52,10.21 10.21,10.21 UART.2
SCK  (via drill 0.35)
  Top 0.152: v33.22,19.96 31.7,18.44 31.7,18.29 31.85,18.14 31.85,17.37 31.7,17.22 31.7,17.07 28.8,14.17 27.28,14.17 24.38,11.28 24.38,10.82 23.47,9.91 22.1,9.91 20.57,11.43 ICSP.3
  Bottom 0.152: v33.22,19.96 43.28,19.96 48.16,24.84 48.16,25.3 U1.19
SERVO1  (via drill 0.35)
  Top 0.152: v41.76,18.75 39.93,20.57 19.2,20.57 16.31,17.68 11.28,17.68 7.62,21.34 SERVO1.1
  Bottom 0.152: v41.76,18.75 42.06,19.05 49.23,19.05 50.44,17.83 50.75,17.83 U1.11
SERVO2  (via drill 0.35)
  Top 0.152: v47.7,14.78 v50.14,14.78
  Bottom 0.152: v50.14,14.78 53.03,17.68 53.34,17.68 U1.12 | v47.7,14.78 47.09,14.78 45.11,12.8 32.77,12.8 28.5,8.53 12.19,8.53 11.28,9.45 11.28,9.6 11.43,9.75 11.43,10.67 11.28,10.82 11.28,10.97 11.43,11.12 11.43,11.43 9.14,13.72 9.14,15.24 7.77,16.61 7.77,17.53 7.62,17.68 SERVO2.1
SERVO3  (via drill 0.35)
  Top 0.152: v51.97,13.41 50.29,11.73 50.29,11.58 48.01,9.3 14.02,9.3 13.26,8.53 7.01,8.53 6.25,9.3 6.25,10.97 7.77,12.5 7.77,13.72 7.62,13.87 SERVO3.1
  Bottom 0.152: v51.97,13.41 55.78,17.22 55.78,17.68 U1.13
TXM
  Top 0.152: U1.3 30.48,17.83 30.02,18.29 30.02,18.44 28.96,19.51 18.59,19.51 10.82,11.73 9.6,11.73 8.08,10.21 7.62,10.21 UART.3
USBD+  (via drill 0.35)
  Top 0.152: v50.44,3.96 50.29,3.81 50.29,2.74 U2.15
  Bottom 0.152: v50.44,3.96 65.38,3.96 75.29,13.87 77.27,13.87 78.79,15.39 78.79,40.69 76.2,43.28 R4.2
USBD-  (via drill 0.35)
  Top 0.152: v54.25,7.01 51.05,3.81 51.05,2.74 U2.16
  Top 0.2: 51,2.66 U2.16
  Bottom 0.152: v54.25,7.01 67.97,7.01 75.13,14.17 77.11,14.17 78.49,15.54 78.49,38.41 76.2,40.69 R5.2
VIN  (via drill 0.35)
  Top 0.152: C1.+ 12.95,19.05 22.86,28.96 23.01,28.96 26.21,32.16 26.21,32.61 27.08,33.48 | v77.57,13.26 77.57,24.08 76.66,24.99 76.66,25.6 76.35,25.91 75.59,25.91 75.13,26.36 v74.98,26.21
  Top 1: 17.96,39.6 17.83,39.73 17.05,39.73 16.23,40.56 16.23,40.78 IC1.1 | 27.2,33.36 27.93,32.63 35.89,32.63 36.12,32.4 55.22,32.4 CON1.+
  Top 1.27: CON1.+ 55.58,33.36 | 27.2,33.36 27.08,33.48 20.96,39.6 17.96,39.6
  Bottom 0.152: v77.57,13.26 77.57,12.95 77.42,12.8 76.2,12.8 R1.2 | v74.98,26.21 75.05,26.28
  Bottom 2: CON1.+ 64.05,41.23 64.05,44.01 65.22,45.17 66.86,45.17 68.03,44.01 68.03,43.45 74.79,36.69 | 74.79,36.69 75.92,35.56 R9.2 | 74.79,36.69 74.79,34.43 74.21,33.84 74.21,32.2 | 74.21,32.2 75.38,31.03 75.65,31.03 R7.2 | R11.2 75.65,25.95 75.38,25.95 75.05,26.28 74.21,27.11 74.21,32.2

### Text on the board
tPlace: Eon / Brian Wong, 2022